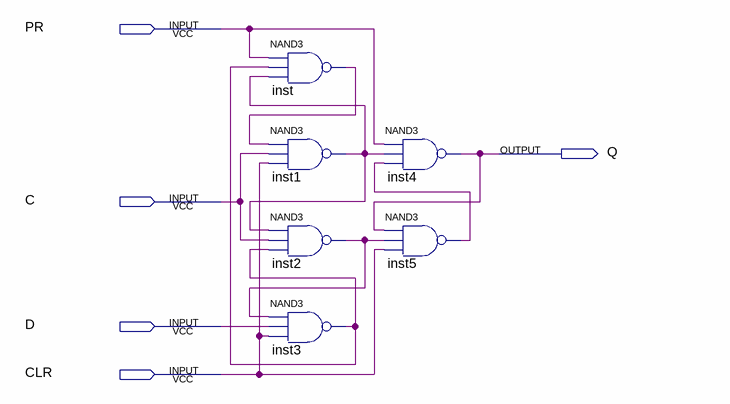
[diagram p0: schematic sheet]
// Quartus schematic dynamical_DTrigger_with_AsyncSetReset.bdf as structural Verilog: 6 symbols, 5 pins
module dynamical_DTrigger_with_AsyncSetReset (
  input  PR,
  input  C,
  input  D,
  input  CLR,
  output Q
);

  wire inst1_out, inst2_out, inst3_out, inst5_out, inst_out;

  nand inst (inst_out, PR, inst3_out, inst1_out);
  nand inst1 (inst1_out, inst_out, C, CLR);
  nand inst2 (inst2_out, inst1_out, C, inst3_out);
  nand inst3 (inst3_out, inst2_out, D, CLR);
  nand inst4 (Q, PR, inst1_out, inst5_out);
  nand inst5 (inst5_out, Q, inst2_out, CLR);
endmodule
